# Altium schematic sheet Main.SchDoc
size A4; SheetNumber: 1; SheetTotal: 1
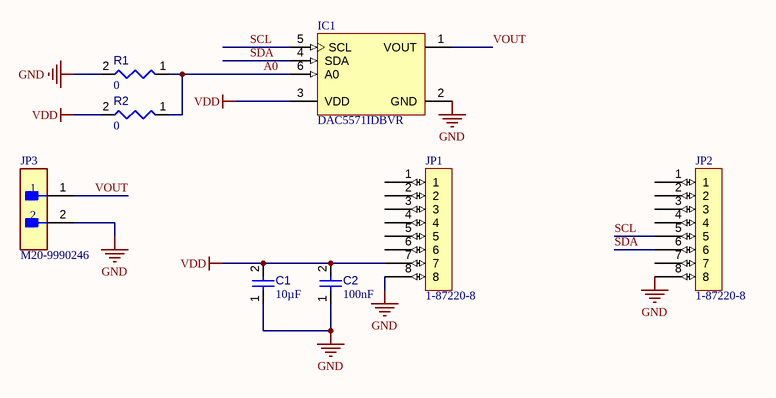
[diagram p0: Main.SchDoc]

## Parts
C1  value 10µF  [CAPC0603(1608)100_L]  (hidden comment: Capacitor 10µF +/-20% 10V 0603)
C2  value 100nF  [CAPC1608X90X40NL10T20]  (hidden comment: Capacitor 100 nF +/-10% 50 V 0603)
IC1  DAC5571IDBVR  [TI-DBV6_L]
JP1  1-87220-8  [1-87220-8-Footprint-1]
JP2  1-87220-8  [1-87220-8-Footprint-1]
JP3  M20-9990246  [FP-M20-9990246-MFG]
R1  value 0  [RESC1608X55X25ML10T15]  (hidden comment: Resistor 100k +/-1% 0603 100 mW)
R2  value 0  [RESC1608X55X25ML10T15]  (hidden comment: Resistor 100k +/-1% 0603 100 mW)

## Nets
GND: C1.1 C2.1 IC1.2(GND) JP1.8 JP2.8 JP3.2 R1.2
VDD: C1.2 C2.2 IC1.3(VDD) JP1.7 R2.2
A0: IC1.6(A0) R1.1 R2.1
SCL: IC1.5(SCL) JP2.5
SDA: IC1.4(SDA) JP2.6
VOUT: IC1.1(VOUT) JP3.1

Not connected (* = marked no-connect by the designer): JP1 1 2 3 4 5 6; JP2 1 2 3 4 7

## Library data of the parts
C1 = CMP-001-00075-4: Chip Capacitor, 10µF +/-20%, 10V, 0603, Thickness 1 mm; Tolerance: 10%; Voltage Rating: 10V; Max Operating Temperature: 85°C; Pins: 2; Case/Package: 0603; Mounting Technology: SMT; Min Operating Temperature: -55°C
C2 = CMP-001-00017-6: Chip Capacitor, 100 nF, +/- 10%, 50 V, 0603 (1608 Metric); Voltage Rating: 50V; Capacitor Type: Ceramic; Tolerance: 10%; Mounting Technology: SM; Max Operating Temperature: 125°C; RoHS Compliant: True; Pins: 2; Case/Package: 0603; Min Operating Temperature: -55°C
IC1 = CMP-001-0000-1: 8 Bit Digital to Analog Converter 1 SOT-23-6
JP1 JP2 = CMP-002-00072-1: Conn Unshrouded Header HDR 1x8 POS 2.54mm Solder ST Thru-Hole Carton
JP3 = CMP-002-00074-1: 2.54mm (0.1") Pitch SIL Vertical PC Tail Pin Header, 6.1mm mating pin height, tin, 2 contacts
R1 R2 = CMP-009-00023-5: Chip Resistor, 100 KOhm, +/- 1%, 0.1 W, -55 to 155 degC, 0603 (1608 Metric); Voltage Rating: 50V; Power: 100mW; Max Operating Temperature: 155°C; RoHS Compliant: True; Tolerance: 1%; Pins: 2; Case/Package: 0603; Mounting Technology: SM; Min Operating Temperature: -55°C